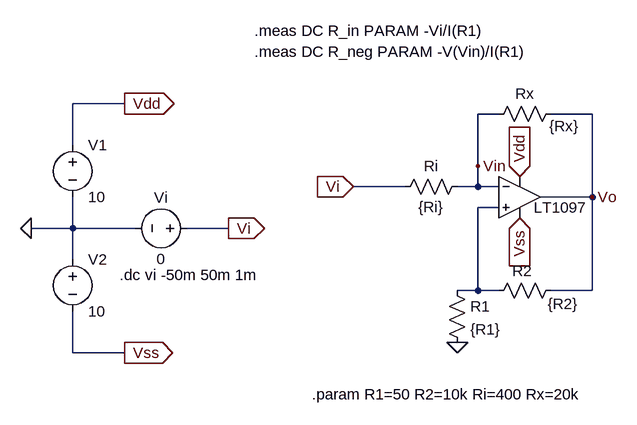
[diagram p0: schematic negative_impedance_converter.asc]
negative_impedance_converter.asc, the LTspice schematic file:
Version 4
SHEET 1 880 680
WIRE -400 16 -480 16
WIRE 176 32 144 32
WIRE 320 32 256 32
WIRE -480 80 -480 16
WIRE 144 112 144 32
WIRE 32 144 -48 144
WIRE 144 144 144 112
WIRE 144 144 112 144
WIRE 176 144 144 144
WIRE 320 160 320 32
WIRE 320 160 240 160
WIRE 176 176 144 176
WIRE -480 208 -480 160
WIRE -480 208 -544 208
WIRE -384 208 -480 208
WIRE -240 208 -304 208
WIRE -480 256 -480 208
WIRE 144 304 144 176
WIRE 144 304 112 304
WIRE 176 304 144 304
WIRE 320 304 320 160
WIRE 320 304 256 304
WIRE -480 400 -480 336
WIRE -400 400 -480 400
FLAG 112 384 0
FLAG 144 112 Vin
FLAG -400 16 Vdd
IOPIN -400 16 Out
FLAG -400 400 Vss
IOPIN -400 400 Out
FLAG -544 208 0
FLAG 208 192 Vss
IOPIN 208 192 In
FLAG -48 144 Vi
IOPIN -48 144 In
FLAG 208 128 Vdd
IOPIN 208 128 In
FLAG -240 208 Vi
IOPIN -240 208 Out
FLAG 320 160 Vo
SYMBOL OpAmps\\LT1097 208 96 R0
WINDOW 0 16 32 Invisible 2
WINDOW 3 22 80 Left 2
SYMATTR InstName U1
SYMBOL res 96 288 R0
SYMATTR InstName R1
SYMATTR Value {R1}
SYMBOL res 272 288 R90
WINDOW 0 1 60 VBottom 2
WINDOW 3 21 -3 VTop 2
SYMATTR InstName R2
SYMATTR Value {R2}
SYMBOL res 272 16 R90
WINDOW 0 0 56 VBottom 2
WINDOW 3 19 -5 VTop 2
SYMATTR InstName Rx
SYMATTR Value {Rx}
SYMBOL res 128 128 R90
WINDOW 0 0 56 VBottom 2
WINDOW 3 32 56 VTop 2
SYMATTR InstName Ri
SYMATTR Value {Ri}
SYMBOL voltage -480 64 R0
WINDOW 123 0 0 Left 0
WINDOW 39 0 0 Left 0
SYMATTR InstName V1
SYMATTR Value 10
SYMBOL voltage -480 240 R0
WINDOW 123 0 0 Left 0
WINDOW 39 0 0 Left 0
SYMATTR InstName V2
SYMATTR Value 10
SYMBOL voltage -288 208 R90
WINDOW 0 -32 56 VBottom 2
WINDOW 3 32 56 VTop 2
SYMATTR InstName Vi
SYMATTR Value 0
TEXT -112 464 Left 2 !.param R1=50 R2=10k Ri=400 Rx=20k
TEXT -408 280 Left 2 !.dc vi -50m 50m 1m
TEXT -200 -64 Left 2 !.meas DC R_neg PARAM -V(Vin)/I(R1)
TEXT -200 -96 Left 2 !.meas DC R_in PARAM -Vi/I(R1)

The netlist it stands for:
* negative_impedance_converter.asc
XU1 N001 Vin Vdd Vss Vo LT1097  ; pins In+ In- V+ V- OUT
R1 N001 0 {R1}
R2 Vo N001 {R2}
Rx Vo Vin {Rx}
Ri Vin Vi {Ri}
V1 Vdd 0 10
V2 0 Vss 10
Vi Vi 0 0
.param R1=50 R2=10k Ri=400 Rx=20k
.dc vi -50m 50m 1m
.meas DC R_neg PARAM -V(Vin)/I(R1)
.meas DC R_in PARAM -Vi/I(R1)
.backanno
.end